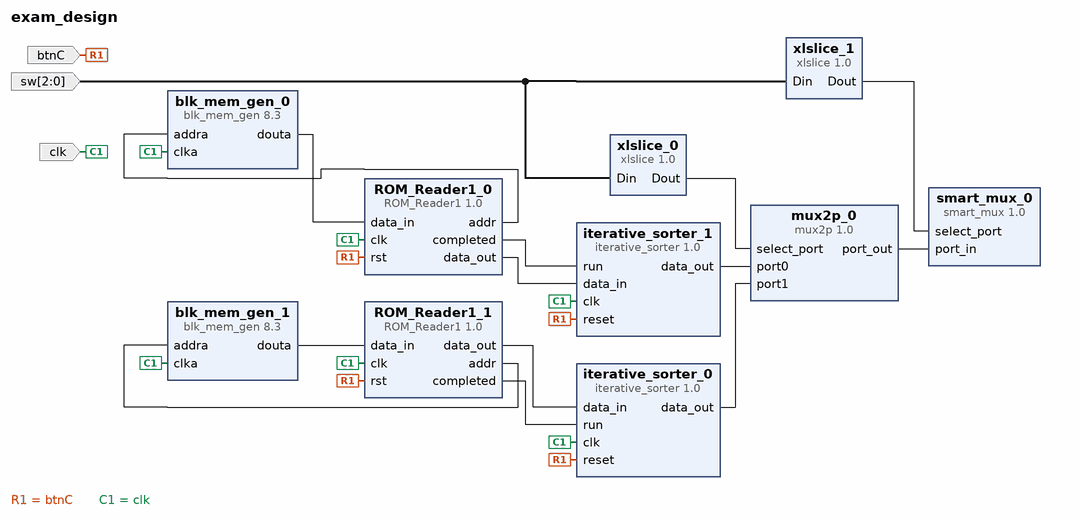
[diagram p0: block diagram of the top level]
# Vivado block design exam_design, Vivado 2015.4
create_bd_design exam_design

create_bd_port -dir I btnC
create_bd_port -dir I clk
create_bd_port -dir I -from 2 -to 0 sw

create_bd_cell -type ip -vlnv xilinx.com:ip:blk_mem_gen:8.3 blk_mem_gen_0
set_property -dict [list \
  CONFIG.Memory_Type Single_Port_ROM \
  CONFIG.Enable_32bit_Address false \
  CONFIG.Write_Width_A 4 \
  CONFIG.Write_Depth_A 4 \
  CONFIG.Enable_A Always_Enabled \
  CONFIG.Register_PortA_Output_of_Memory_Primitives false \
  CONFIG.Load_Init_File true \
  CONFIG.Coe_File ../../../../../../../../../Memoria/4words4bits_1.coe \
  CONFIG.Use_RSTA_Pin false \
  CONFIG.Port_A_Write_Rate 0 \
  CONFIG.use_bram_block Stand_Alone \
] [get_bd_cells blk_mem_gen_0]
create_bd_cell -type ip -vlnv xilinx.com:ip:blk_mem_gen:8.3 blk_mem_gen_1
set_property -dict [list \
  CONFIG.Memory_Type Single_Port_ROM \
  CONFIG.Enable_32bit_Address false \
  CONFIG.Write_Width_A 4 \
  CONFIG.Write_Depth_A 4 \
  CONFIG.Enable_A Always_Enabled \
  CONFIG.Register_PortA_Output_of_Memory_Primitives false \
  CONFIG.Load_Init_File true \
  CONFIG.Coe_File ../../../../../../../../../Memoria/4words4bits_2.coe \
  CONFIG.Use_RSTA_Pin false \
  CONFIG.Port_A_Write_Rate 0 \
  CONFIG.use_bram_block Stand_Alone \
] [get_bd_cells blk_mem_gen_1]
create_bd_cell -type ip -vlnv user.org:user:ROM_Reader1:1.0 ROM_Reader1_0
set_property -dict {CONFIG.data_width 4 CONFIG.address_bits 2} [get_bd_cells ROM_Reader1_0]
create_bd_cell -type ip -vlnv user.org:user:ROM_Reader1:1.0 ROM_Reader1_1
set_property -dict {CONFIG.data_width 4 CONFIG.address_bits 2} [get_bd_cells ROM_Reader1_1]
create_bd_cell -type ip -vlnv user.org:user:iterative_sorter:1.0 iterative_sorter_0
set_property -dict {CONFIG.how_many_words 4 CONFIG.word_length 4} [get_bd_cells iterative_sorter_0]
create_bd_cell -type ip -vlnv user.org:user:iterative_sorter:1.0 iterative_sorter_1
set_property -dict {CONFIG.how_many_words 4 CONFIG.word_length 4} [get_bd_cells iterative_sorter_1]
create_bd_cell -type ip -vlnv user.org:user:mux2p:1.0 mux2p_0
create_bd_cell -type ip -vlnv xilinx.com:ip:xlslice:1.0 xlslice_0
set_property -dict {CONFIG.DIN_TO 0 CONFIG.DIN_FROM 0 CONFIG.DIN_WIDTH 3} [get_bd_cells xlslice_0]
create_bd_cell -type ip -vlnv xilinx.com:ip:xlslice:1.0 xlslice_1
set_property -dict {CONFIG.DOUT_WIDTH 2 CONFIG.DIN_TO 1 CONFIG.DIN_FROM 2 CONFIG.DIN_WIDTH 3} [get_bd_cells xlslice_1]
create_bd_cell -type ip -vlnv user.org:user:smart_mux:1.0 smart_mux_0
set_property -dict {CONFIG.data_width 4} [get_bd_cells smart_mux_0]

# ---- connections ----

connect_bd_net [get_bd_ports btnC] \
  [get_bd_pins ROM_Reader1_0/rst] [get_bd_pins ROM_Reader1_1/rst] [get_bd_pins iterative_sorter_0/reset] \
  [get_bd_pins iterative_sorter_1/reset]
connect_bd_net [get_bd_ports clk] \
  [get_bd_pins ROM_Reader1_0/clk] [get_bd_pins blk_mem_gen_1/clka] [get_bd_pins blk_mem_gen_0/clka] \
  [get_bd_pins ROM_Reader1_1/clk] [get_bd_pins iterative_sorter_0/clk] [get_bd_pins iterative_sorter_1/clk]
connect_bd_net [get_bd_pins blk_mem_gen_0/douta] [get_bd_pins ROM_Reader1_0/data_in]
connect_bd_net [get_bd_pins blk_mem_gen_1/douta] [get_bd_pins ROM_Reader1_1/data_in]
connect_bd_net [get_bd_pins ROM_Reader1_1/addr] [get_bd_pins blk_mem_gen_1/addra]
connect_bd_net [get_bd_pins ROM_Reader1_0/addr] [get_bd_pins blk_mem_gen_0/addra]
connect_bd_net [get_bd_pins ROM_Reader1_1/data_out] [get_bd_pins iterative_sorter_0/data_in]
connect_bd_net [get_bd_pins ROM_Reader1_1/completed] [get_bd_pins iterative_sorter_0/run]
connect_bd_net [get_bd_pins ROM_Reader1_0/completed] [get_bd_pins iterative_sorter_1/run]
connect_bd_net [get_bd_pins ROM_Reader1_0/data_out] [get_bd_pins iterative_sorter_1/data_in]
connect_bd_net [get_bd_pins iterative_sorter_1/data_out] [get_bd_pins mux2p_0/port0]
connect_bd_net [get_bd_pins iterative_sorter_0/data_out] [get_bd_pins mux2p_0/port1]
connect_bd_net [get_bd_ports sw] [get_bd_pins xlslice_0/Din] [get_bd_pins xlslice_1/Din]
connect_bd_net [get_bd_pins xlslice_0/Dout] [get_bd_pins mux2p_0/select_port]
connect_bd_net [get_bd_pins xlslice_1/Dout] [get_bd_pins smart_mux_0/select_port]
connect_bd_net [get_bd_pins mux2p_0/port_out] [get_bd_pins smart_mux_0/port_in]

validate_bd_design
save_bd_design
